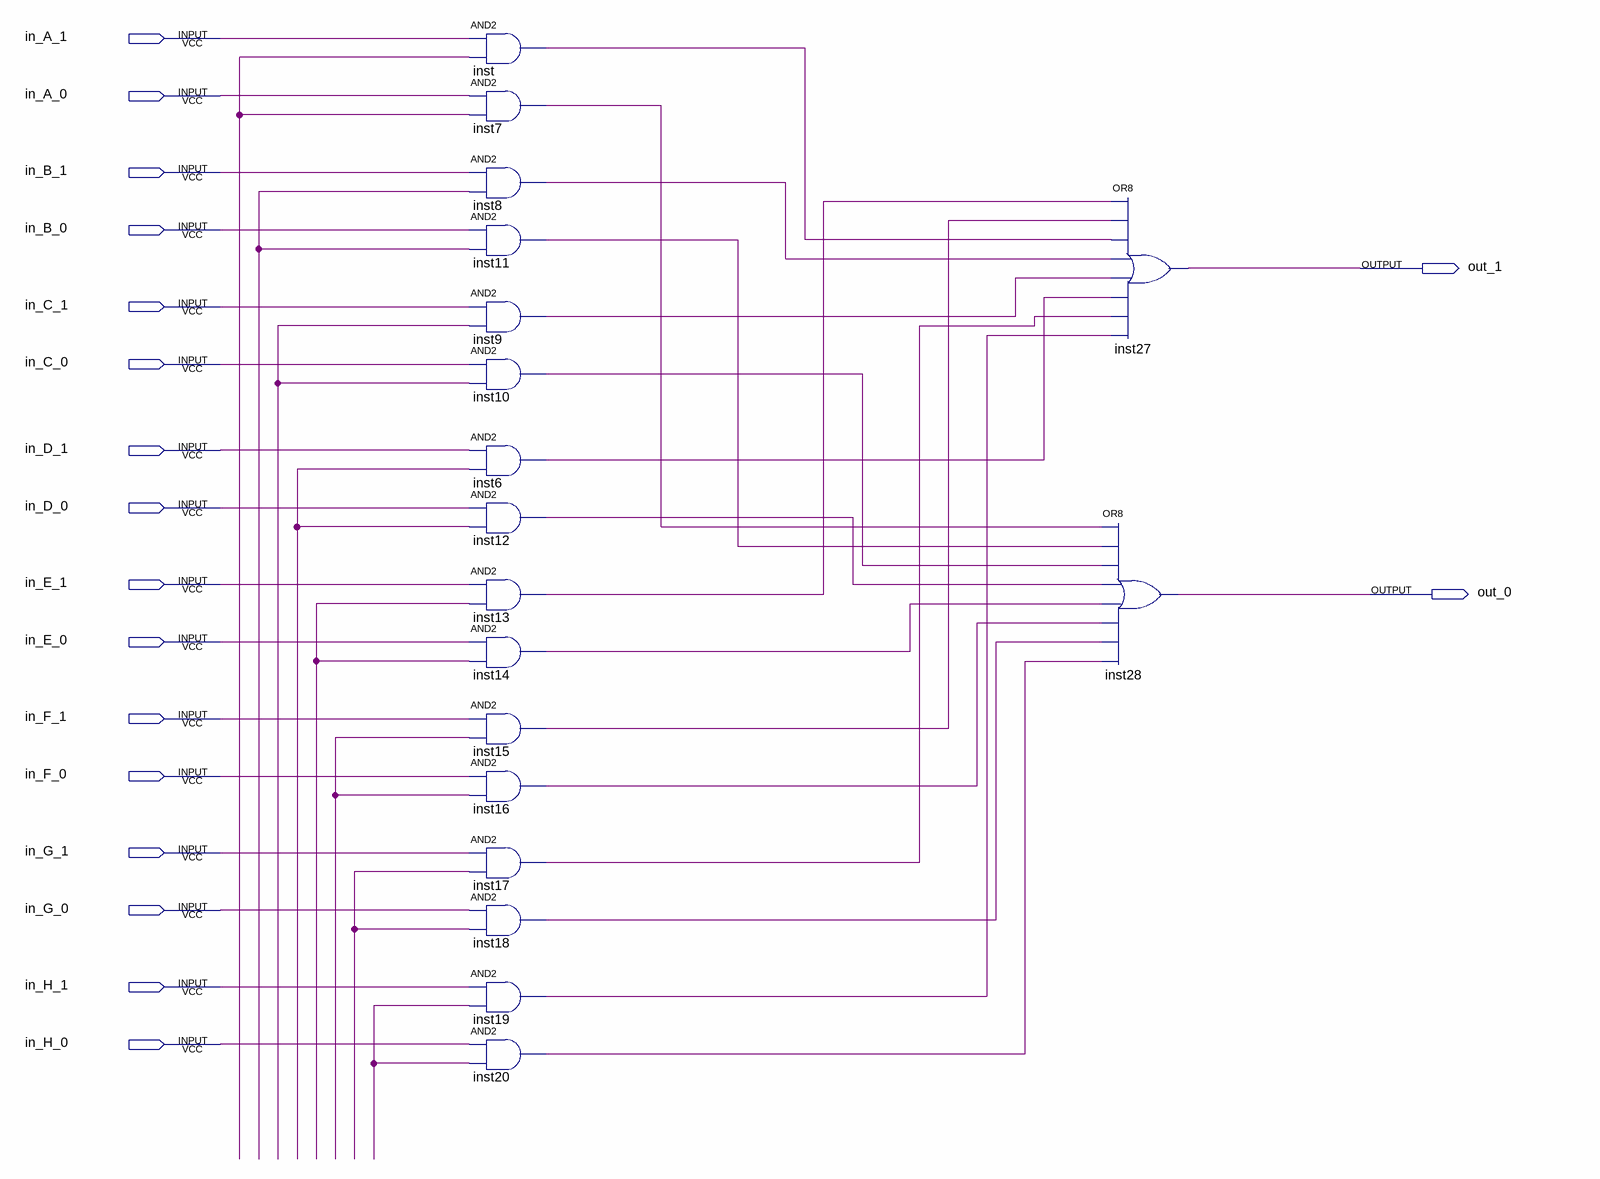
[diagram p0: schematic sheet]
// Quartus schematic alu2b.bdf as structural Verilog: 18 symbols, 18 pins
module alu2b (
  input  in_A_1,
  input  in_A_0,
  input  in_B_1,
  input  in_B_0,
  input  in_C_1,
  input  in_C_0,
  input  in_D_1,
  input  in_D_0,
  input  in_E_1,
  input  in_E_0,
  input  in_F_1,
  input  in_F_0,
  input  in_G_1,
  input  in_G_0,
  input  in_H_1,
  input  in_H_0,
  output out_1,
  output out_0
);

  wire inst6_out, inst7_out, inst8_out, inst9_out, inst10_out, inst11_out, inst12_out, inst13_out,
       inst14_out, inst15_out, inst16_out, inst17_out, inst18_out, inst19_out, inst20_out, inst_out,
       undriven, undriven_2, undriven_3, undriven_4, undriven_5, undriven_6, undriven_7, undriven_8;

  and inst (inst_out, in_A_1, undriven);
  and inst7 (inst7_out, in_A_0, undriven);
  and inst8 (inst8_out, in_B_1, undriven_2);
  and inst11 (inst11_out, in_B_0, undriven_2);
  and inst9 (inst9_out, in_C_1, undriven_3);
  and inst10 (inst10_out, in_C_0, undriven_3);
  and inst6 (inst6_out, in_D_1, undriven_4);
  and inst12 (inst12_out, in_D_0, undriven_4);
  and inst13 (inst13_out, in_E_1, undriven_5);
  and inst14 (inst14_out, in_E_0, undriven_5);
  and inst15 (inst15_out, in_F_1, undriven_6);
  and inst16 (inst16_out, in_F_0, undriven_6);
  and inst17 (inst17_out, in_G_1, undriven_7);
  and inst18 (inst18_out, in_G_0, undriven_7);
  and inst19 (inst19_out, in_H_1, undriven_8);
  and inst20 (inst20_out, in_H_0, undriven_8);
  or inst27 (out_1, inst13_out, inst15_out, inst_out, inst8_out, inst9_out, inst6_out, inst17_out, inst19_out);
  or inst28 (out_0, inst7_out, inst11_out, inst10_out, inst12_out, inst14_out, inst16_out, inst18_out, inst20_out);
endmodule
